# EAGLE design lora_receiver (EAGLE 9.6.2)
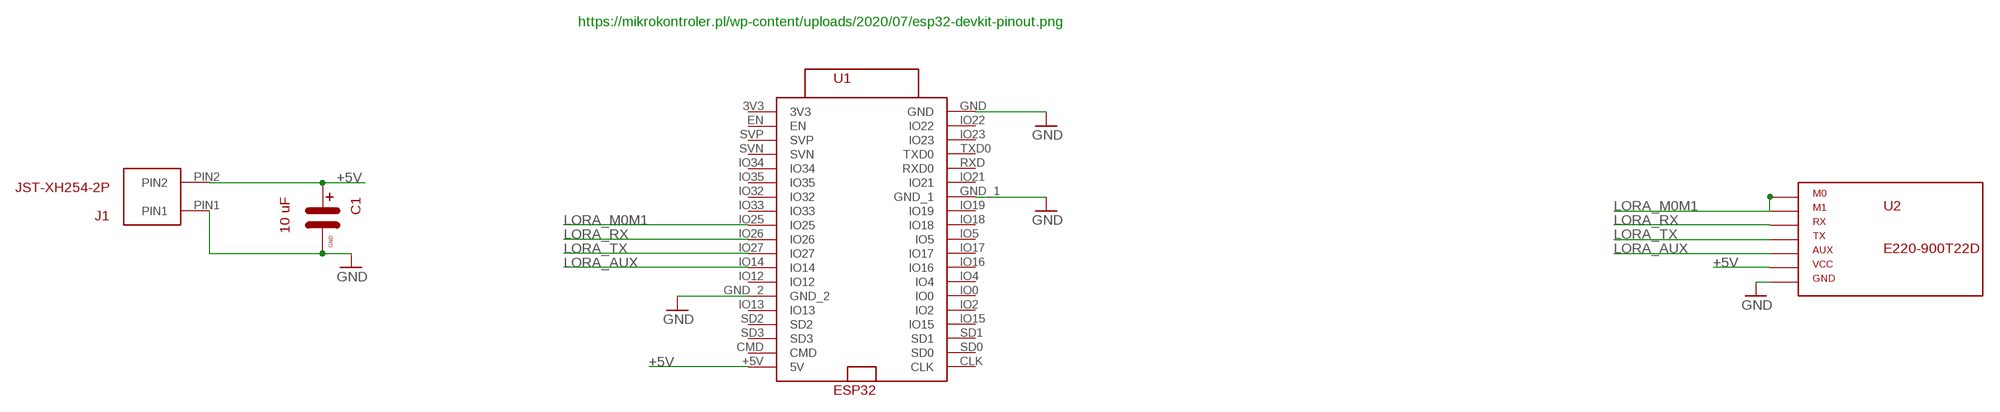
[diagram p0: schematic, sheet 1]

## Parts
C1  10 uF  CMINI-5X7  [C-MINI-5X7]
J1  JST-XH254-2P  [JST-XH254-2P]
U1  ESP32  [ESP32]
U2  E220-900T22D  LORA  [LORA]

## Nets
+5V: C1.PLUS(PIN_PLUS) J1.PIN2 U1.+5V(5V) U2.VCC
GND: C1.MINUS(PIN_GND) J1.PIN1 U1.GND U1.GND_1 U1.GND_2 U2.GND
LORA_AUX: U1.IO14 U2.AUX
LORA_M0M1: U1.IO25 U2.M0 U2.M1
LORA_RX: U1.IO26 U2.RX
LORA_TX: U1.IO27 U2.TX
Unconnected: U1.CLK U1.CMD U1.EN U1.IO0 U1.IO2 U1.IO4 U1.IO5 U1.IO12 U1.IO13 U1.IO15 U1.IO16 U1.IO17 U1.IO18 U1.IO19 U1.IO21 U1.IO22 U1.IO23 U1.IO32 U1.IO33 U1.IO34 U1.IO35 U1.RXD(RXD0) U1.SD0 U1.SD1 U1.SD2 U1.SD3 U1.SVN U1.SVP U1.TXD0

## Notes on the sheet
- https://mikrokontroler.pl/wp-content/uploads/2020/07/esp32-devkit-pinout.png

## Power pins joined to a net without a drawn wire
3V3: U1.3V3

## Library data of the parts
C1 = my_devices:C
J1 = my_devices:JST-XH254-2P
U1 = my_devices:ESP32
U2 = my_devices:LORA

## Board
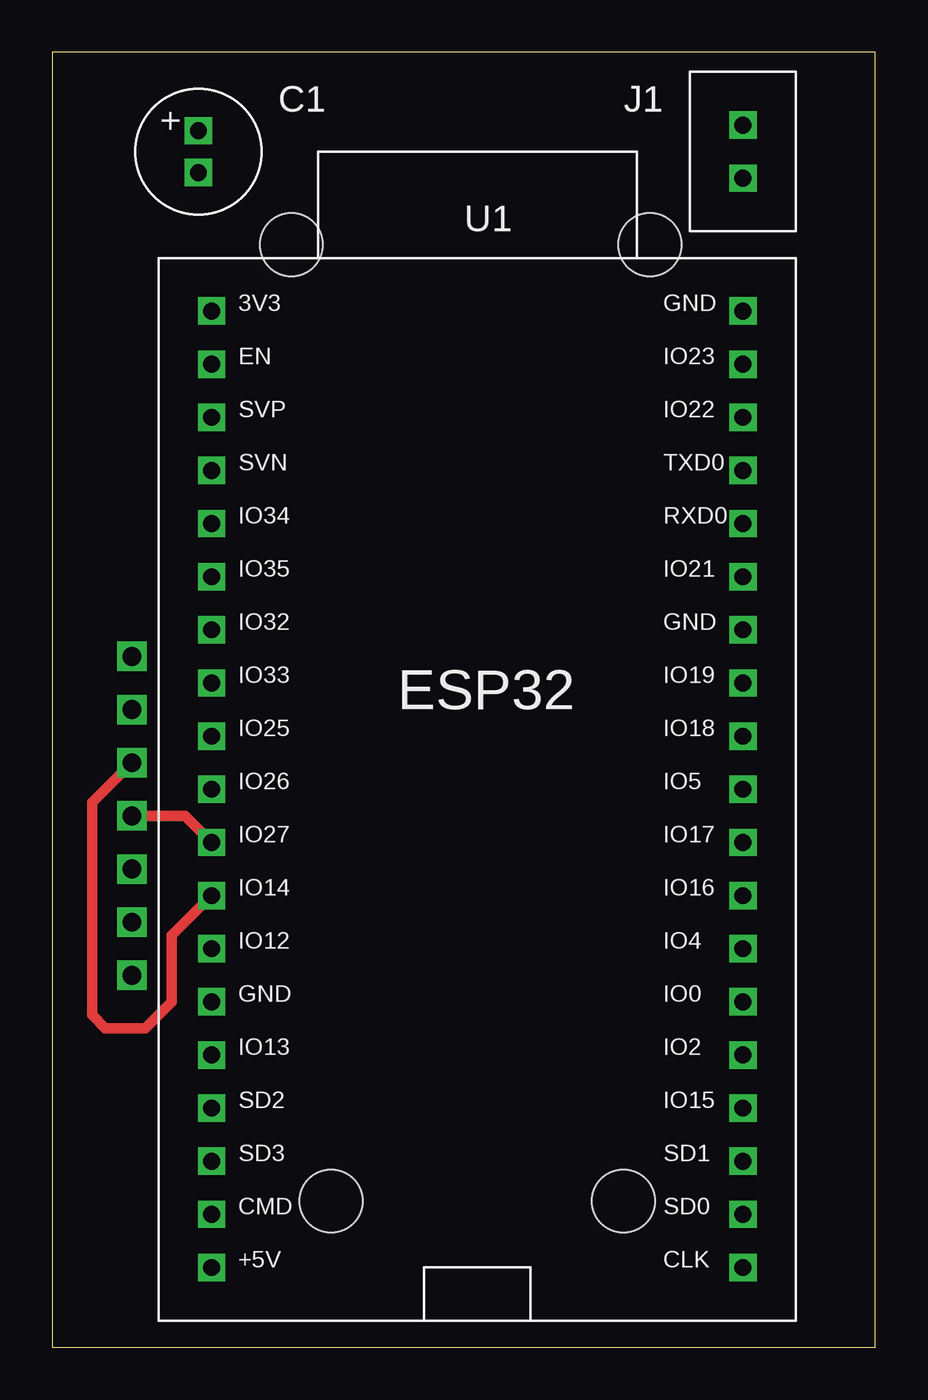
[diagram p1: board, top side]
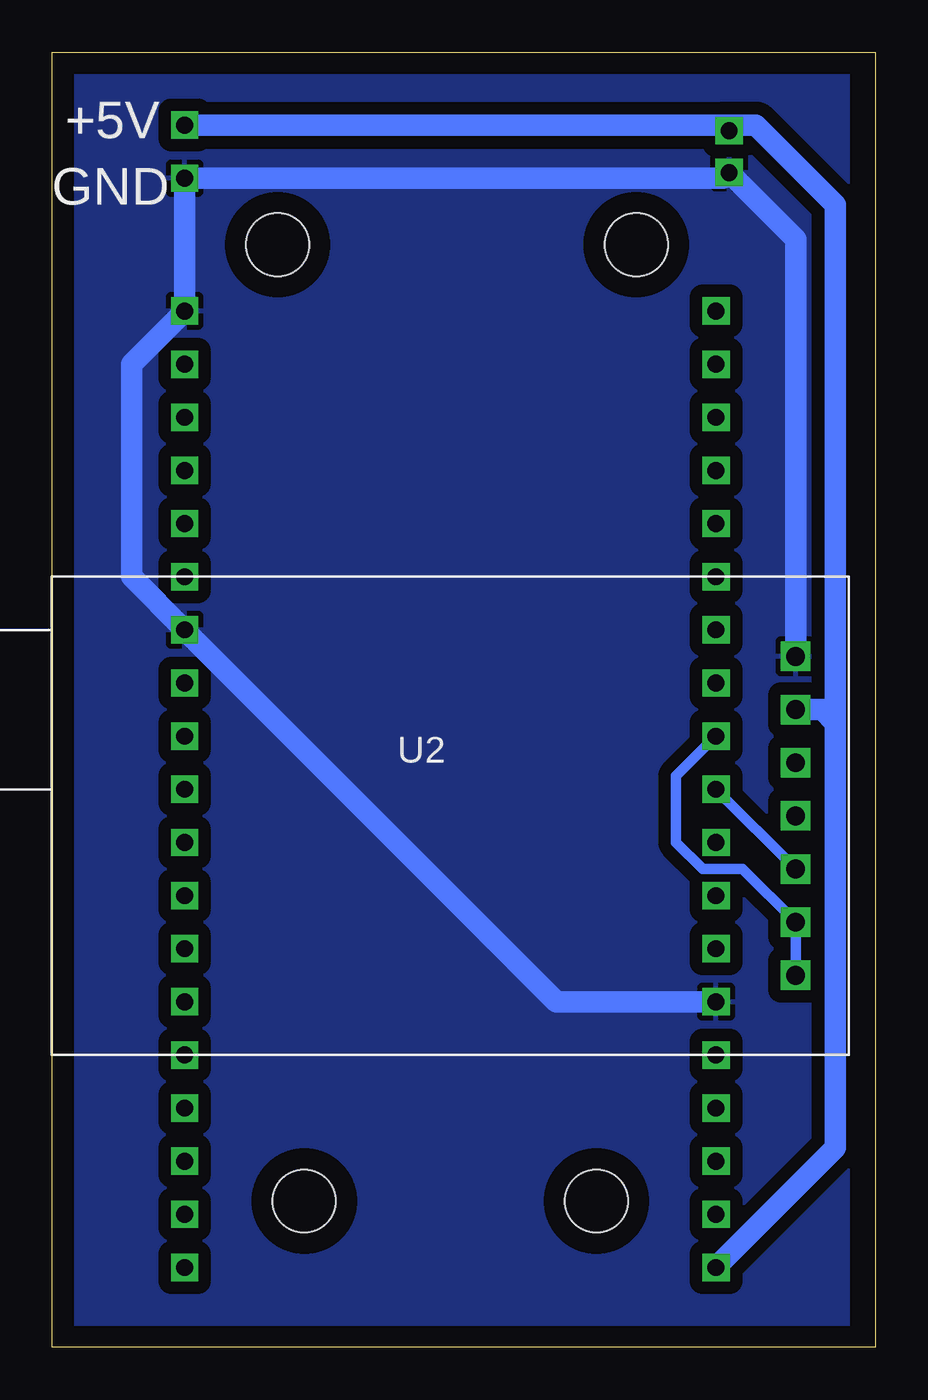
[diagram p2: board, bottom side, seen from below]

Size 39.35 x 61.9 mm. Coordinates in mm from the lower left corner, seen from the top.
Outline: 0,0 39.35,0 39.35,61.9 0,61.9 0,0
Copper layers (1*16): Top 0.035mm / dielectric 1.5mm / Bottom 0.035mm
Design rules "default": minimum track width 6mil, minimum drill 0.35mm, track to track 6mil, track to pad 6mil, pad to pad 6mil, via to via 6mil, smd to smd 6mil, copper to edge 40mil, drill to drill 6mil, minimum pad ring 10mil, minimum via ring 8mil, stop-mask expansion 4mil, vias tented up to drill 0mil, thermal gap 10mil
Holes 3 mm at 13.34,6.99 27.3,6.99 11.43,52.7 28.57,52.7

### Footprints (pad centres in the part's own frame; a part is rotated, then mirrored left to right if it is on the bottom)
C-MINI-5X7 = drill 0.8 square: MINUS 1,0; PLUS -1,0
JST-XH254-2P = drill 0.8 square: PIN1 -1.27,0; PIN2 1.27,0
ESP32 = drill 0.8 square: 3V3 -12.7,22.86; +5V -12.7,-22.86; CLK 12.7,-22.86; CMD -12.7,-20.32; EN -12.7,20.32; GND 12.7,22.86; GND_1 12.7,7.62; GND_2 -12.7,-10.16; IO0 12.7,-10.16; IO2 12.7,-12.7; IO4 12.7,-7.62; IO5 12.7,0; IO12 -12.7,-7.62; IO13 -12.7,-12.7; IO14 -12.7,-5.08; IO15 12.7,-15.24; IO16 12.7,-5.08; IO17 12.7,-2.54; IO18 12.7,2.54; IO19 12.7,5.08; IO21 12.7,10.16; IO22 12.7,17.78; IO23 12.7,20.32; IO25 -12.7,2.54; IO26 -12.7,0; IO27 -12.7,-2.54; IO32 -12.7,7.62; IO33 -12.7,5.08; IO34 -12.7,12.7; IO35 -12.7,10.16; RXD 12.7,12.7; SD0 12.7,-20.32; SD1 12.7,-17.78; SD2 -12.7,-15.24; SD3 -12.7,-17.78; SVN -12.7,15.24; SVP -12.7,17.78; TXD0 12.7,15.24
LORA = drill 0.9 square: AUX 16.51,2.54; GND 16.51,7.62; M0 16.51,-7.62; M1 16.51,-5.08; RX 16.51,-2.54; TX 16.51,0; VCC 16.51,5.08

### Placement (x,y rotation side)
C1  6.98,57.15 270 top
J1  33.02,57.15 90 top
U1  20.32,26.67 0 top
U2  20.32,25.4 0 bottom

### Tracks (layer width: path | path; a pad name or v marks a point on that pad's centre or on a via)
+5V
  Bottom 1.016: U1.+5V 1.91,9.53 1.91,29.85 | J1.PIN2 7.26,58.42 | 7.26,58.42 C1.PLUS | 7.26,58.42 5.72,58.42 1.91,54.61 1.91,29.85 | 1.91,29.85 2.54,30.48 U2.VCC
GND
  Bottom 1.016: U1.GND_2 15.24,16.51 U1.GND_1 35.56,36.83 35.56,46.99 U1.GND J1.PIN1 7.26,55.88 C1.MINUS 3.81,52.97 U2.GND
  pour Bottom (isolate 0.61): 1.27,60.96 38.74,60.96 38.74,0.63 1.27,0.63
LORA_AUX
  Top 0.508: U2.AUX 1.91,26.04 1.91,15.87 2.54,15.24 4.45,15.24 5.72,16.51 5.72,19.68 U1.IO14
LORA_M0M1
  Bottom 0.508: U1.IO25 9.52,27.3 9.52,24.13 8.26,22.86 6.35,22.86 U2.M1 U2.M0
LORA_RX
  Bottom 0.508: U2.RX U1.IO26
LORA_TX
  Top 0.508: U2.TX 6.35,25.4 U1.IO27

### Text on the board
bNames: +5V | GND